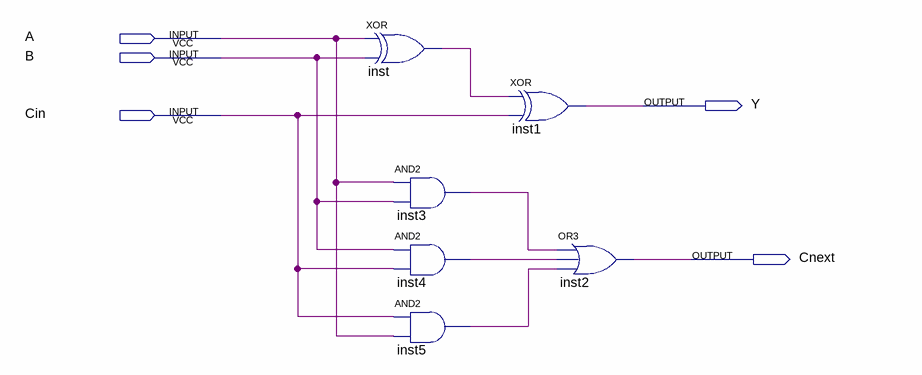
[diagram p0: schematic sheet]
// Quartus schematic FullAdder.bdf as structural Verilog: 6 symbols, 5 pins
module FullAdder (
  input  A,
  input  B,
  input  Cin,
  output Y,
  output Cnext
);

  wire inst3_out, inst4_out, inst5_out, inst_out;

  xor inst (inst_out, A, B);
  and inst3 (inst3_out, A, B);
  and inst4 (inst4_out, B, Cin);
  and inst5 (inst5_out, Cin, A);
  xor inst1 (Y, inst_out, Cin);
  or inst2 (Cnext, inst3_out, inst4_out, inst5_out);
endmodule
